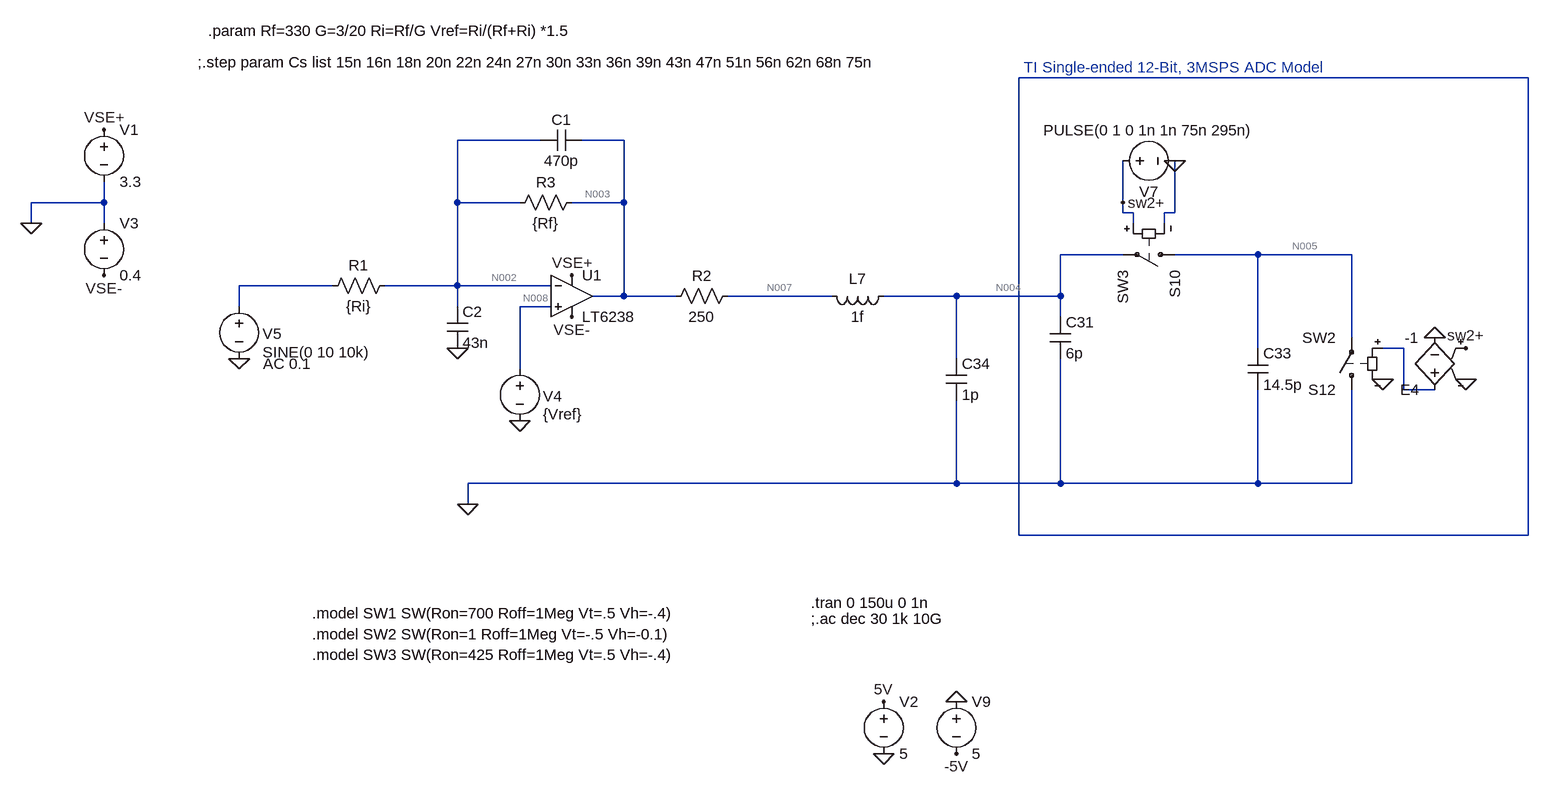
[diagram p0: schematic TI_DSP_single_ended_adc_with_offset.asc]
TI_DSP_single_ended_adc_with_offset.asc, the LTspice schematic file:
Version 4
SHEET 1 4964 2100
WIRE 4960 -416 4176 -416
WIRE 3440 -320 3312 -320
WIRE 3568 -320 3504 -320
WIRE 2768 -224 2768 -256
WIRE 2768 -224 2656 -224
WIRE 3312 -224 3312 -320
WIRE 3408 -224 3312 -224
WIRE 3568 -224 3568 -320
WIRE 3568 -224 3488 -224
WIRE 4336 -224 4336 -288
WIRE 4336 -208 4336 -224
WIRE 4352 -208 4336 -208
WIRE 4416 -208 4416 -288
WIRE 4416 -208 4400 -208
WIRE 2656 -192 2656 -224
WIRE 2768 -192 2768 -224
WIRE 4352 -192 4352 -208
WIRE 4400 -192 4400 -208
WIRE 4336 -144 4240 -144
WIRE 4544 -144 4416 -144
WIRE 4688 -144 4544 -144
WIRE 3120 -96 2976 -96
WIRE 3312 -96 3312 -224
WIRE 3312 -96 3200 -96
WIRE 3456 -96 3312 -96
WIRE 3568 -80 3568 -224
WIRE 3568 -80 3520 -80
WIRE 3648 -80 3568 -80
WIRE 3888 -80 3728 -80
WIRE 4080 -80 3968 -80
WIRE 4240 -80 4240 -144
WIRE 4240 -80 4080 -80
WIRE 2976 -64 2976 -96
WIRE 3312 -64 3312 -96
WIRE 3456 -64 3408 -64
WIRE 4240 -48 4240 -80
WIRE 4688 -16 4688 -144
WIRE 4544 0 4544 -144
WIRE 4768 0 4736 0
WIRE 4080 16 4080 -80
WIRE 3408 32 3408 -64
WIRE 4768 64 4768 0
WIRE 4816 64 4768 64
WIRE 4080 208 4080 80
WIRE 4080 208 3328 208
WIRE 4240 208 4240 16
WIRE 4240 208 4080 208
WIRE 4544 208 4544 64
WIRE 4544 208 4240 208
WIRE 4688 208 4688 64
WIRE 4688 208 4544 208
WIRE 3328 240 3328 208
WIRE 4176 288 4176 -416
WIRE 4960 288 4960 -416
WIRE 4960 288 4176 288
FLAG 3968 624 0
FLAG 3968 544 5V
FLAG 4416 -288 0
FLAG 4864 0 sw2+
FLAG 4864 48 0
FLAG 4816 -16 0
FLAG 4736 48 0
FLAG 3328 240 0
FLAG 4080 544 0
FLAG 4080 624 -5V
FLAG 4336 -224 sw2+
FLAG 2768 -336 VSE+
FLAG 2656 -192 0
FLAG 2768 -112 VSE-
FLAG 3488 -112 VSE+
FLAG 3488 -48 VSE-
FLAG 3408 112 0
FLAG 2976 16 0
FLAG 3312 0 0
SYMBOL voltage 3968 528 R0
WINDOW 123 0 0 Left 0
WINDOW 39 0 0 Left 0
SYMATTR InstName V2
SYMATTR Value 5
SYMBOL cap 4224 -48 R0
SYMATTR InstName C31
SYMATTR Value 6p
SYMBOL sw 4432 -144 R90
SYMATTR InstName S10
SYMATTR Value SW3
SYMBOL cap 4528 0 R0
SYMATTR InstName C33
SYMATTR Value 14.5p
SYMBOL voltage 4320 -288 R270
WINDOW 0 -32 56 VBottom 2
WINDOW 3 32 56 VTop 2
WINDOW 123 0 0 Left 0
WINDOW 39 0 0 Left 0
SYMATTR InstName V7
SYMATTR Value PULSE(0 1 0 1n 1n 75n 295n)
SYMBOL res 3744 -96 R90
WINDOW 0 0 56 VBottom 2
WINDOW 3 32 56 VTop 2
SYMATTR InstName R2
SYMATTR Value 250
SYMBOL cap 4064 16 R0
SYMATTR InstName C34
SYMATTR Value 1p
SYMBOL sw 4688 80 R180
SYMATTR InstName S12
SYMATTR Value SW2
SYMBOL e2 4816 80 R180
SYMATTR InstName E4
SYMATTR Value -1
SYMBOL ind 3984 -96 R90
WINDOW 0 5 56 VBottom 2
WINDOW 3 32 56 VTop 2
SYMATTR InstName L7
SYMATTR Value 1f
SYMBOL voltage 4080 528 R0
WINDOW 123 0 0 Left 0
WINDOW 39 0 0 Left 0
SYMATTR InstName V9
SYMATTR Value 5
SYMBOL voltage 2768 -352 R0
WINDOW 123 0 0 Left 0
WINDOW 39 0 0 Left 0
SYMATTR InstName V1
SYMATTR Value 3.3
SYMBOL voltage 2768 -208 R0
WINDOW 123 0 0 Left 0
WINDOW 39 0 0 Left 0
SYMATTR InstName V3
SYMATTR Value 0.4
SYMBOL voltage 3408 16 R0
WINDOW 123 37 104 Left 2
WINDOW 39 0 0 Left 0
WINDOW 0 36 58 Left 2
WINDOW 3 36 86 Left 2
SYMATTR InstName V4
SYMATTR Value {Vref}
SYMBOL Opamps\\LT6238 3488 -80 R0
SYMATTR InstName U1
SYMBOL res 3216 -112 R90
WINDOW 0 0 56 VBottom 2
WINDOW 3 32 56 VTop 2
SYMATTR InstName R1
SYMATTR Value {Ri}
SYMBOL res 3504 -240 R90
WINDOW 0 0 56 VBottom 2
WINDOW 3 32 56 VTop 2
SYMATTR InstName R3
SYMATTR Value {Rf}
SYMBOL voltage 2976 -80 R0
WINDOW 123 37 104 Left 2
WINDOW 39 0 0 Left 0
WINDOW 0 36 58 Left 2
WINDOW 3 36 86 Left 2
SYMATTR Value2 AC 0.1
SYMATTR InstName V5
SYMATTR Value SINE(0 10 10k)
SYMBOL cap 3504 -336 R90
WINDOW 0 0 32 VBottom 2
WINDOW 3 32 32 VTop 2
SYMATTR InstName C1
SYMATTR Value 470p
SYMBOL cap 3296 -64 R0
SYMATTR InstName C2
SYMATTR Value 43n
TEXT 3856 392 Left 2 !.tran 0 150u 0 1n
TEXT 3088 408 Left 2 !.model SW1 SW(Ron=700 Roff=1Meg Vt=.5 Vh=-.4)
TEXT 3088 440 Left 2 !.model SW2 SW(Ron=1 Roff=1Meg Vt=-.5 Vh=-0.1)
TEXT 3856 416 Left 2 !;.ac dec 30 1k 10G
TEXT 3088 472 Left 2 !.model SW3 SW(Ron=425 Roff=1Meg Vt=.5 Vh=-.4)
TEXT 4184 -432 Left 2 ;TI Single-ended 12-Bit, 3MSPS ADC Model
TEXT 2928 -488 Left 2 !.param Rf=330 G=3/20 Ri=Rf/G Vref=Ri/(Rf+Ri) *1.5
TEXT 2912 -440 Left 2 !;.step param Cs list 15n 16n 18n 20n 22n 24n 27n 30n 33n 36n 39n 43n 47n 51n 56n 62n 68n 75n

The netlist it stands for:
* TI_DSP_single_ended_adc_with_offset.asc
V2 5V 0 5
C31 N004 0 6p
S10 N005 N004 sw2+ 0 SW3
C33 N005 0 14.5p
V7 sw2+ 0 PULSE(0 1 0 1n 1n 75n 295n)
R2 N007 N003 250
C34 N004 0 1p
S12 0 N005 N009 0 SW2
E4 N009 0 sw2+ 0 -1
L7 N004 N007 1f
V9 0 -5V 5
V1 VSE+ 0 3.3
V3 0 VSE- 0.4
V4 N008 0 {Vref}
* U1: LT6238 (symbol Opamps\LT6238 not available, pins judged from their places): In+=N008 In-=N002 V+=VSE+ V-=VSE- OUT=N003
R1 N002 N006 {Ri}
R3 N003 N002 {Rf}
V5 N006 0 SINE(0 10 10k) AC 0.1
C1 N003 N002 470p
C2 N002 0 43n
.tran 0 150u 0 1n
.model SW1 SW(Ron=700 Roff=1Meg Vt=.5 Vh=-.4)
.model SW2 SW(Ron=1 Roff=1Meg Vt=-.5 Vh=-0.1)
;.ac dec 30 1k 10G
.model SW3 SW(Ron=425 Roff=1Meg Vt=.5 Vh=-.4)
* TI Single-ended 12-Bit, 3MSPS ADC Model
.param Rf=330 G=3/20 Ri=Rf/G Vref=Ri/(Rf+Ri) *1.5
;.step param Cs list 15n 16n 18n 20n 22n 24n 27n 30n 33n 36n 39n 43n 47n 51n 56n 62n 68n 75n
.backanno
.end

* Results of the author's LTspice run, read from the files saved beside the schematic
* Operating Point, zero values left out:
*   V(5v) = 5 V
*   V(n004) = 1.501 V
*   V(n005) = 1.501 µV
*   V(n007) = 1.501 V
*   V(n003) = 1.502 V
*   V(-5v) = -5 V
*   V(vse+) = 3.3 V
*   V(vse-) = -400 mV
*   V(n008) = 1.304 V
*   V(n002) = 1.304 V
*   I(L7) = -1.501 µA
*   I(R3) = 597.9 µA
*   I(R1) = 592.9 µA
*   I(R2) = -1.501 µA
*   I(S12) = 1.501 µA
*   I(S10) = 1.501 µA
*   I(V5) = 592.9 µA
*   I(V4) = -4.994 µA
*   I(V3) = -2.786 mA
*   I(V1) = -3.375 mA
*   Ix(u1:1) = 4.994 µA
*   Ix(u1:2) = 4.993 µA
*   Ix(u1:3) = -599.4 µA
*   Ix(u1:4) = 3.375 mA
*   Ix(u1:5) = -2.786 mA